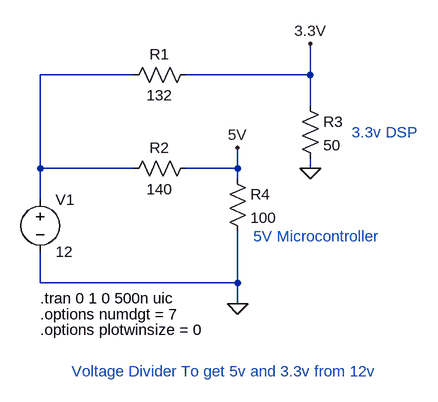
[diagram p0: schematic Voltage Divider.asc]
Voltage Divider.asc, the LTspice schematic file:
Version 4
SHEET 1 880 680
WIRE 208 48 64 48
WIRE 480 48 480 0
WIRE 480 48 288 48
WIRE 480 96 480 48
WIRE 64 192 64 48
WIRE 208 192 64 192
WIRE 368 192 368 160
WIRE 368 192 288 192
WIRE 480 192 480 176
WIRE 368 208 368 192
WIRE 64 240 64 192
WIRE 64 368 64 320
WIRE 368 368 368 288
WIRE 368 368 64 368
WIRE 368 400 368 368
FLAG 480 192 0
FLAG 368 160 5V
FLAG 480 0 3.3V
FLAG 368 400 0
SYMBOL voltage 64 224 R0
WINDOW 123 0 0 Left 0
WINDOW 39 0 0 Left 0
SYMATTR InstName V1
SYMATTR Value 12
SYMBOL res 304 32 R90
WINDOW 0 0 56 VBottom 2
WINDOW 3 32 56 VTop 2
SYMATTR InstName R1
SYMATTR Value 132
SYMBOL res 304 176 R90
WINDOW 0 0 56 VBottom 2
WINDOW 3 32 56 VTop 2
SYMATTR InstName R2
SYMATTR Value 140
SYMBOL res 464 80 R0
SYMATTR InstName R3
SYMATTR Value 50
SYMBOL res 352 192 R0
SYMATTR InstName R4
SYMATTR Value 100
TEXT 64 392 Left 2 !.tran 0 1 0 500n uic
TEXT 64 416 Left 2 !.options numdgt = 7
TEXT 64 440 Left 2 !.options plotwinsize = 0
TEXT 544 136 Left 2 ;3.3v DSP
TEXT 392 296 Left 2 ;5V Microcontroller
TEXT 112 504 Left 2 ;Voltage Divider To get 5v and 3.3v from 12v

The netlist it stands for:
* Voltage Divider.asc
V1 N001 0 12
R1 3.3V N001 132
R2 5V N001 140
R3 3.3V 0 50
R4 5V 0 100
.tran 0 1 0 500n uic
.options numdgt = 7
.options plotwinsize = 0
* 3.3v DSP
* 5V Microcontroller
* Voltage Divider To get 5v and 3.3v from 12v
.backanno
.end